# EAGLE design Dog_Fountain_1_2 (EAGLE 6.5.0)
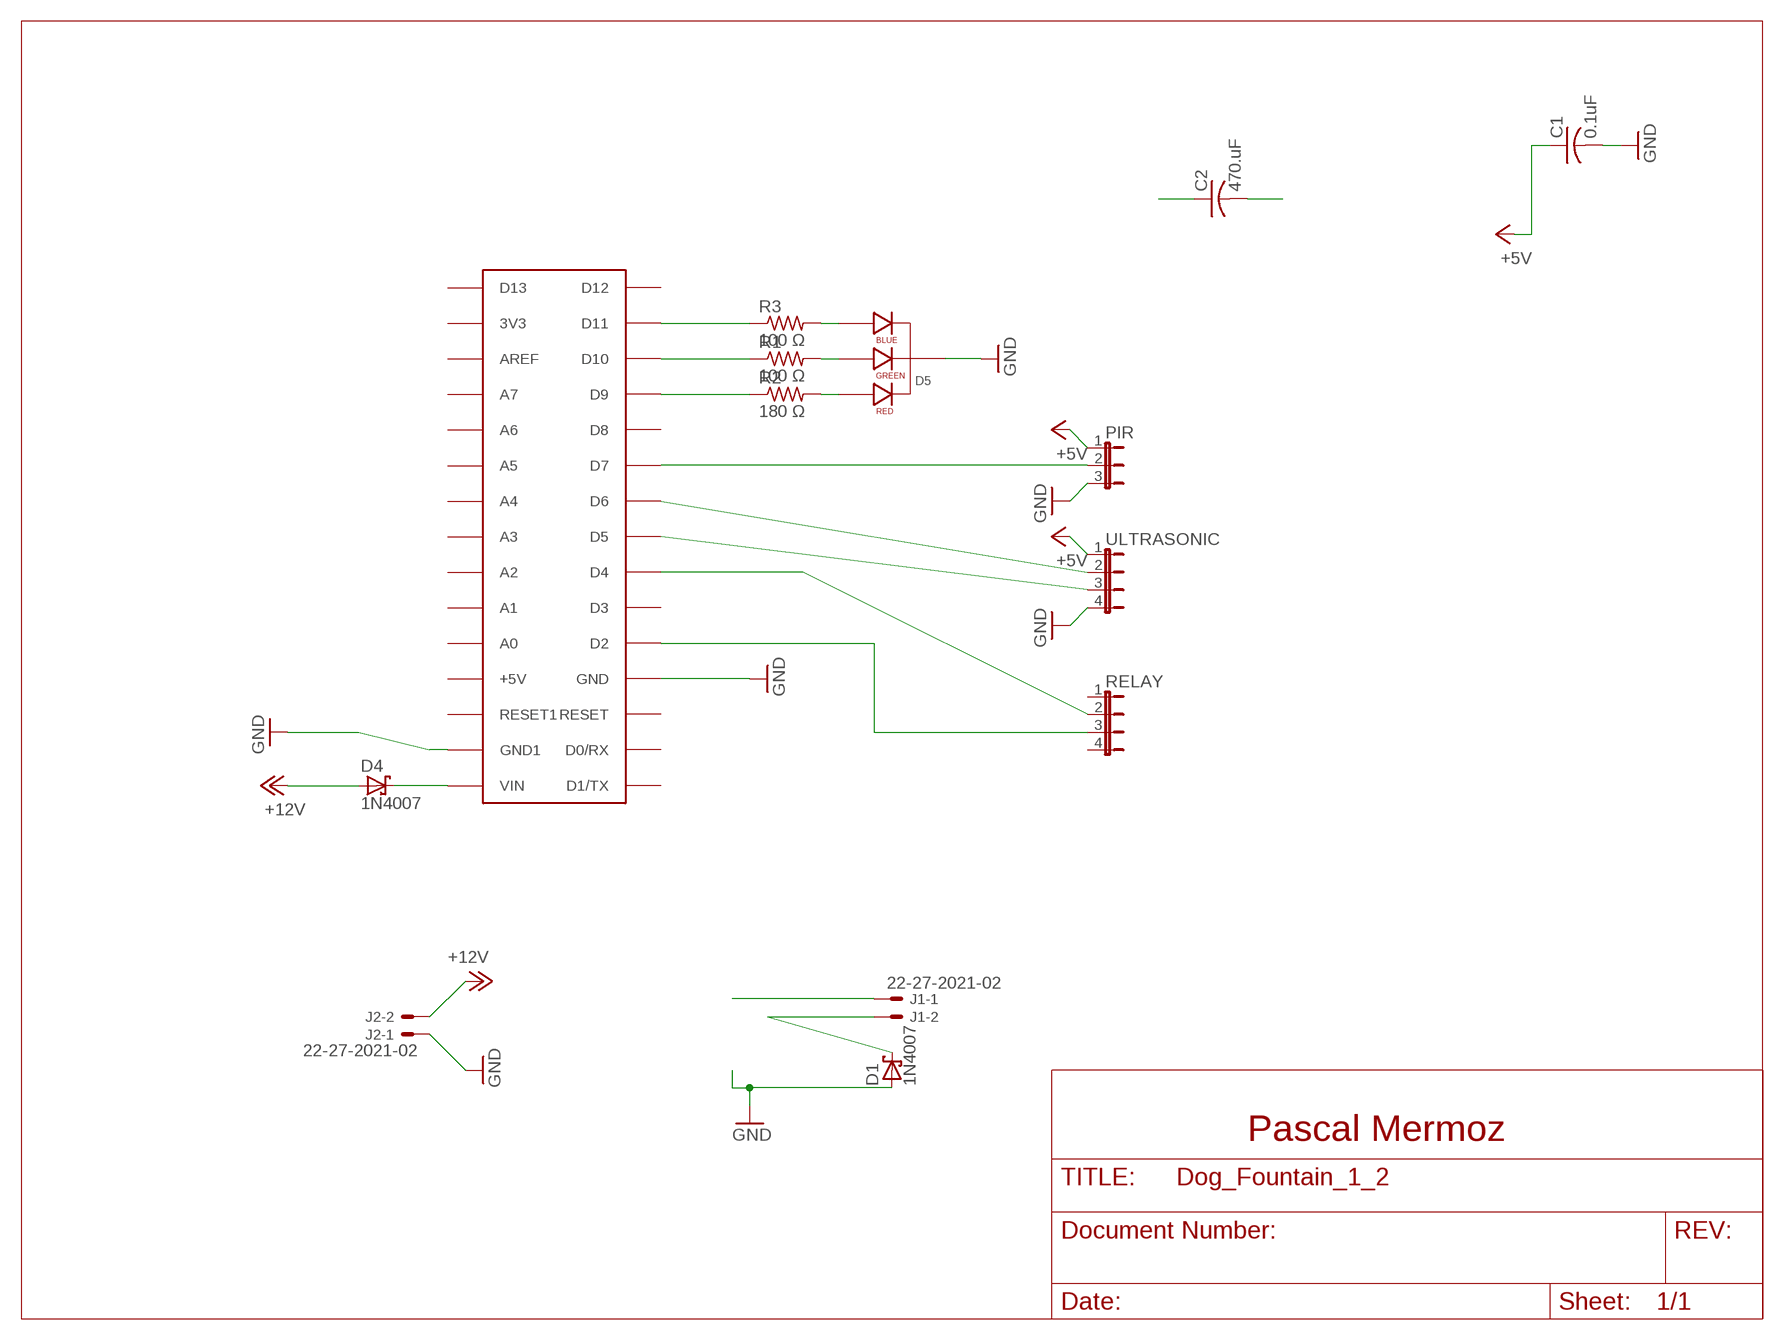
[diagram p0: schematic, sheet 1]

## Parts
C1  0.1uF  C-US050-024X044  [C050-024X044]
C2  470.uF  C-US050-024X044  [C050-024X044]
D1  1N4007  1N5818-B  [DO41-7.6]
D4  1N4007  1N5818-B  [DO41-7.6]
D5  LED-RGB-CC-THRUDIFFUSE  [LED-RGB-THRU]
J1  22-27-2021-02  [6410-02]
J2  22-27-2021-02  [6410-02]
PIR  JP2E  [JP2]
R1  100 Ω  R-US_0204/2V  [0204V]
R2  180 Ω  R-US_0204/2V  [0204V]
R3  100 Ω  R-US_0204/2V  [0204V]
RELAY  JP4E  [JP4]
U$1  ARDUINONANO  [PDIP-32]
ULTRASONIC  JP4E  [JP4]

## Nets
+5V: C1.1 PIR.1 ULTRASONIC.1
+12V: D4.A J2.2
GND: C1.2 D1.A D5.2(CATHODE) J2.1 PIR.3 U$1.GND1 ULTRASONIC.4
N$3: C2.1
N$4: C2.2
N$5: U$1.VIN
N$6: D1.C J1.2
N$7: J1.1
N$8: U$1.GND
N$9: R3.1 U$1.D11
N$10: R1.1 U$1.D10
N$11: PIR.2
N$12: ULTRASONIC.2
N$13: ULTRASONIC.3
N$14: R2.1 U$1.D9
N$15: RELAY.2 U$1.D4
N$17: D5.1(RED_CATHODE) R2.2
N$18: D5.3(GREEN_CATHODE) R1.2
N$19: D5.4(BLUE_CATHODE) R3.2
N$24: RELAY.3 U$1.D2
Unconnected: D4.C RELAY.1 RELAY.4 U$1.3V3 U$1.+5V U$1.A0 U$1.A1 U$1.A2 U$1.A3 U$1.A4 U$1.A5 U$1.A6 U$1.A7 U$1.AREF U$1.D0/RX U$1.D1/TX U$1.D3 U$1.D5 U$1.D6 U$1.D7 U$1.D8 U$1.D12 U$1.D13 U$1.RESET U$1.RESET1

## Notes on the sheet
- Pascal Mermoz

## Library data of the parts
C1 C2 = rcl:C-US: CAPACITOR, American symbol; MPN: C317C104K5R5TA; OC_NEWARK: 60M1325
D1 D4 = diode:1N581*: 1.0A SCHOTTKY BARRIER RECTIFIER Source: http://www.diodes.com/datasheets/ds23001.pdf; MPN: KBP202G; OC_NEWARK: 90R8778
D5 = SparkFun-LED:LED-RGB-CC-THRU: RGB Through-hole common cathode LED SparkFun Storefront: COM-00105 (Clear) COM-09264 (Diffuse); PROD_ID: DIO-09434
J1 J2 = con-molex:22-?-02: CONNECTOR wire to board 2.54 mm (.1 inch) pitch header; OC_FARNELL: unknown; OC_NEWARK: unknown
PIR = jumper:JP2E: JUMPER
R1-R3 = rcl:R-US_: RESISTOR, American symbol
RELAY ULTRASONIC = jumper:JP4E: JUMPER
U$1 = jet-lib:ARDUINONANO; MPN: A000005; OC_NEWARK: 13T9275

## Net classes
0 default: width 0.305 mm, drill 0.508 mm, clearance 0.254 mm

## Board
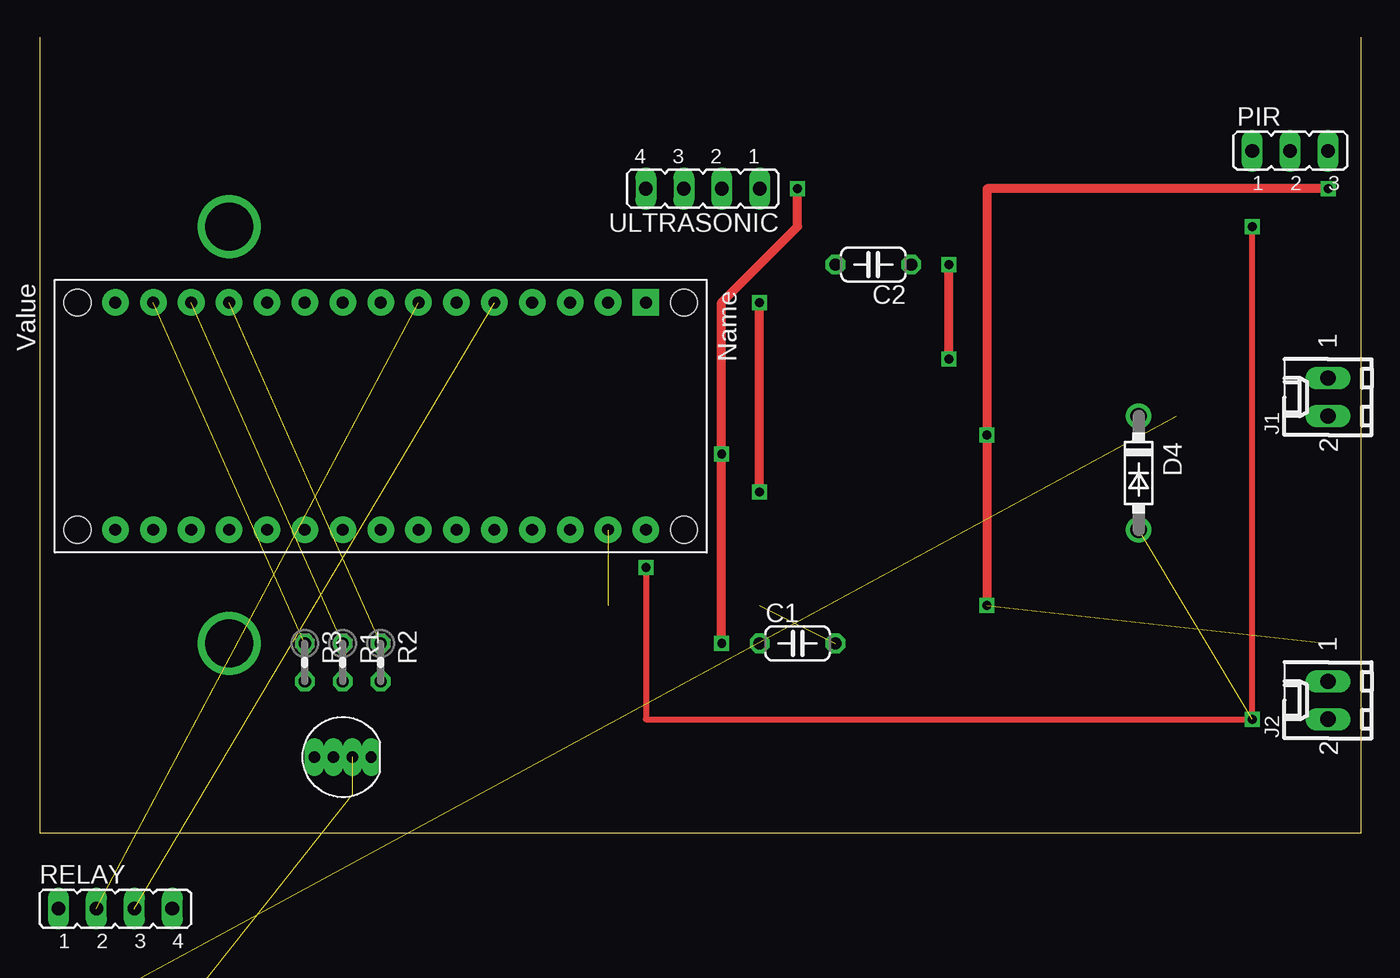
[diagram p1: board, top side]
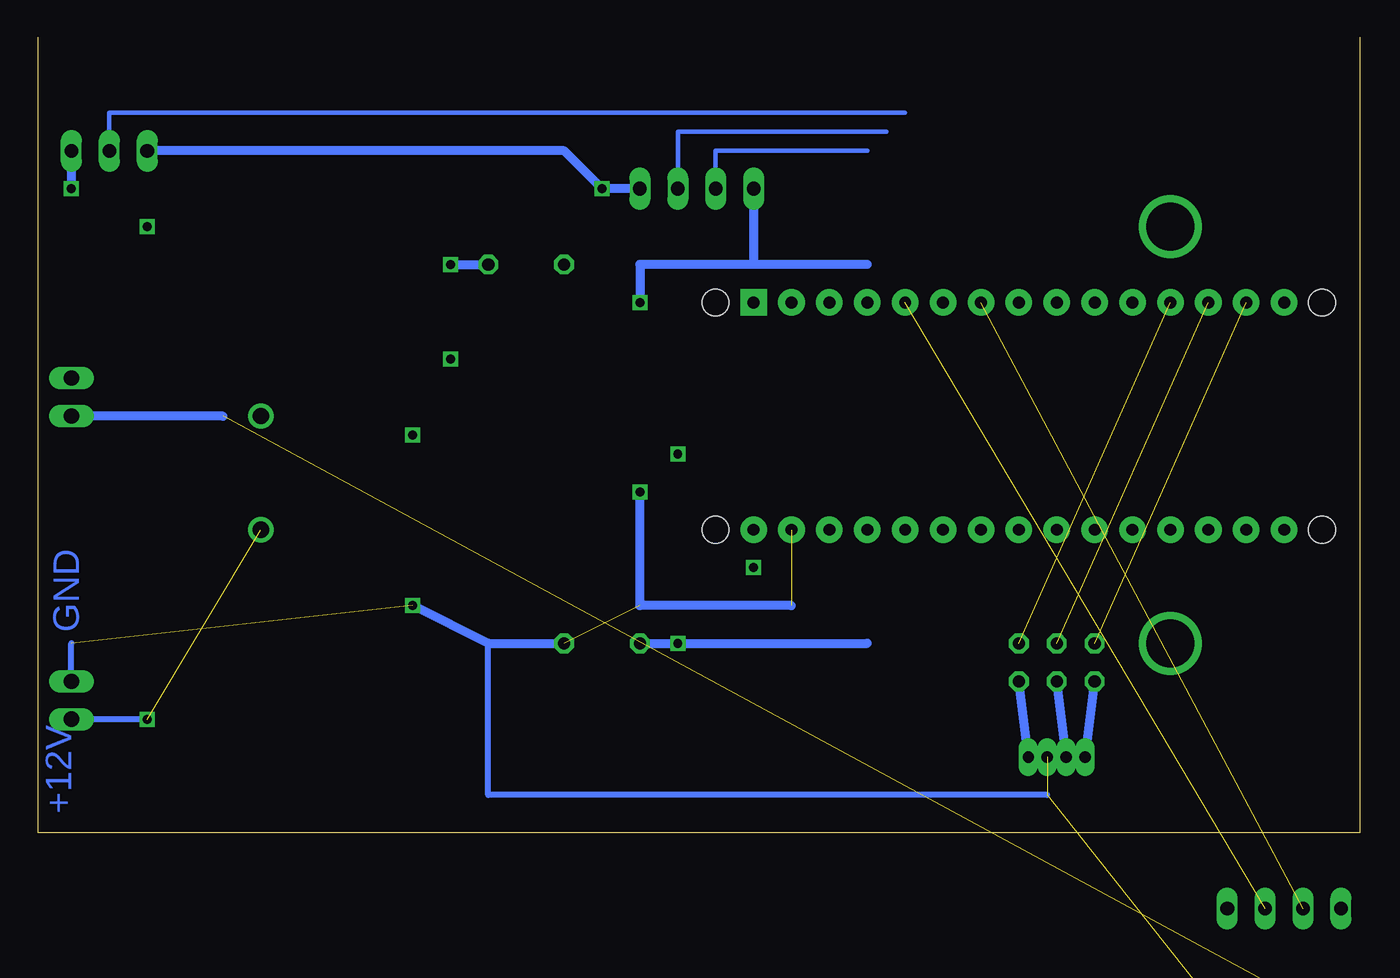
[diagram p2: board, bottom side, seen from below]

Size 88.57 x 53.33 mm. Coordinates in mm from the lower left corner, seen from the top.
Outline: 88.57,53.33 88.57,0 0,0 0,53.33
Copper layers (1*16): Top 0.035mm / dielectric 1.5mm / Bottom 0.035mm
Design rules "default": minimum track width 10mil, minimum drill 24mil, track to track 8mil, track to pad 8mil, pad to pad 8mil, via to via 8mil, smd to smd 8mil, copper to edge 40mil, drill to drill 8mil, minimum pad ring 10mil, minimum via ring 8mil, stop-mask expansion 4mil, vias tented up to drill 0mil, thermal gap 10mil
tRestrict: area 22.9,45.7 to 66,53.3; area 40.6,44.5 to 48.3,45.7; area 68.6,43.2 to 78.7,53.3; area 78.7,48.3 to 88.9,53.3; area 88.9,43.2 to 99.1,53.3
bRestrict: 1 lines
vRestrict: area 0,45.7 to 7.6,53.3; area 0,0 to 7.6,7.6

### Footprints (pad centres in the part's own frame; a part is rotated, then mirrored left to right if it is on the bottom)
C050-024X044 = drill 0.813 octagon: 1 -2.54,0; 2 2.54,0
DO41-7.6 = drill 1.1 pad 1.7: A 3.81,0; C -3.81,0
LED-RGB-THRU = drill 0.762 pad 0.889 long: 1 1.905,0; 2 0.635,0; 3 -0.635,0; 4 -1.905,0
6410-02 = drill 1.016 long: 1 1.27,0; 2 -1.27,0
JP2 = drill 0.914 long: 1 -2.54,0; 2 0,0; 3 2.54,0
0204V = drill 0.813 octagon: 1 -1.27,0; 2 1.27,0
JP4 = drill 0.914 long: 1 -3.81,0; 2 -1.27,0; 3 1.27,0; 4 3.81,0
PDIP-32 = drill 0.8 pad 1.778: 3V3 15.24,-35.56; +5V 15.24,-10.16; A0 15.24,-12.7; A1 15.24,-15.24; A2 15.24,-17.78; A3 15.24,-20.32; A4 15.24,-22.86; A5 15.24,-25.4; A6 15.24,-27.94; A7 15.24,-30.48; AREF 15.24,-33.02; D0/RX 0,-5.08; D2 0,-12.7; D3 0,-15.24; D4 0,-17.78; D5 0,-20.32; D6 0,-22.86; D7 0,-25.4; D8 0,-27.94; D9 0,-30.48; D10 0,-33.02; D11 0,-35.56; D12 0,-38.1; D13 15.24,-38.1; GND 0,-10.16; GND1 15.24,-5.08; RESET 0,-7.62; RESET1 15.24,-7.62; VIN 15.24,-2.54 | drill 0.8 pad 1.778 square: D1/TX 0,-2.54 | hole 1.778: 0,0; 0,-40.64; 15.24,-40.64; 15.24,0

### Placement (x,y rotation side)
C1  50.8,12.7 0 top
C2  55.88,38.1 180 top
D1  5.08,-12.7 0 top  (outside the outline)
D4  73.66,24.13 270 top
D5  20.32,5.08 0 top
J1  86.36,29.21 90 top
J2  86.36,8.89 90 top
PIR  83.82,45.72 0 top
R1  20.32,11.43 270 top
R2  22.86,11.43 270 top
R3  17.78,11.43 270 top
RELAY  5.08,-5.08 0 top  (outside the outline)
U$1  43.18,35.56 270 top
ULTRASONIC  44.45,43.18 180 top

### Tracks (layer width: path | path; a pad name or v marks a point on that pad's centre or on a via)
+5V  (via drill 0.6)
  Top 0.61: v45.72,12.7 v45.72,25.4 45.72,35.56 50.8,40.64 v50.8,43.18
  Bottom 0.61: C1.1 v45.72,12.7 33.02,12.7 | PIR.1 53.34,45.72 v50.8,43.18 ULTRASONIC.1
+12V  (via drill 0.6)  (1 unrouted)
  Top 0.406: v40.64,17.78 40.64,7.62 v81.28,7.62 81.28,40.64
  Bottom 0.406: v81.28,7.62 J2.2
GND  (via drill 0.6)  (5 unrouted)
  Top 0.61: v48.26,22.86 v48.26,35.56 | v86.36,43.18 63.5,43.18 v63.5,26.67 v63.5,15.24
  Bottom 0.406: J2.1 86.36,12.7 | 20.95,2.54 58.42,2.54 58.42,12.7
  Bottom 0.61: v48.26,22.86 48.26,15.24 38.1,15.24 | v63.5,15.24 58.42,12.7 C1.2 | PIR.3 v86.36,43.18 | 33.02,38.1 40.64,38.1 | 40.64,38.1 48.26,38.1 v48.26,35.56 | ULTRASONIC.4 40.64,38.1
N$1  (via drill 3.2)
  other vias: 12.7,40.64
N$2  (via drill 3.2)
  other vias: 12.7,12.7
N$3  (via drill 0.6)
  Top 0.61: v60.96,31.75 v60.96,38.1
  Bottom 0.61: v60.96,38.1 C2.1
N$6  (1 unrouted)
  Bottom 0.61: 76.2,27.94 J1.2
N$9  (1 unrouted)
N$10  (1 unrouted)
N$11
  Bottom 0.305: PIR.2 83.82,48.26 30.48,48.26
N$12
  Bottom 0.305: ULTRASONIC.2 45.72,46.99 31.75,46.99
N$13
  Bottom 0.305: ULTRASONIC.3 43.18,45.72 33.02,45.72
N$14  (1 unrouted)
N$15  (1 unrouted)
N$17
  Bottom 0.61: D5.1 R2.2
N$18
  Bottom 0.61: D5.3 R1.2
N$19
  Bottom 0.61: D5.4 R3.2
N$24  (1 unrouted)
N$29  (via drill 0.6)
  other vias: 81.28,40.64

### Text on the board
Bottom: GND | +12V